# EAGLE design magicmouth-v0.1 (EAGLE 6.3)
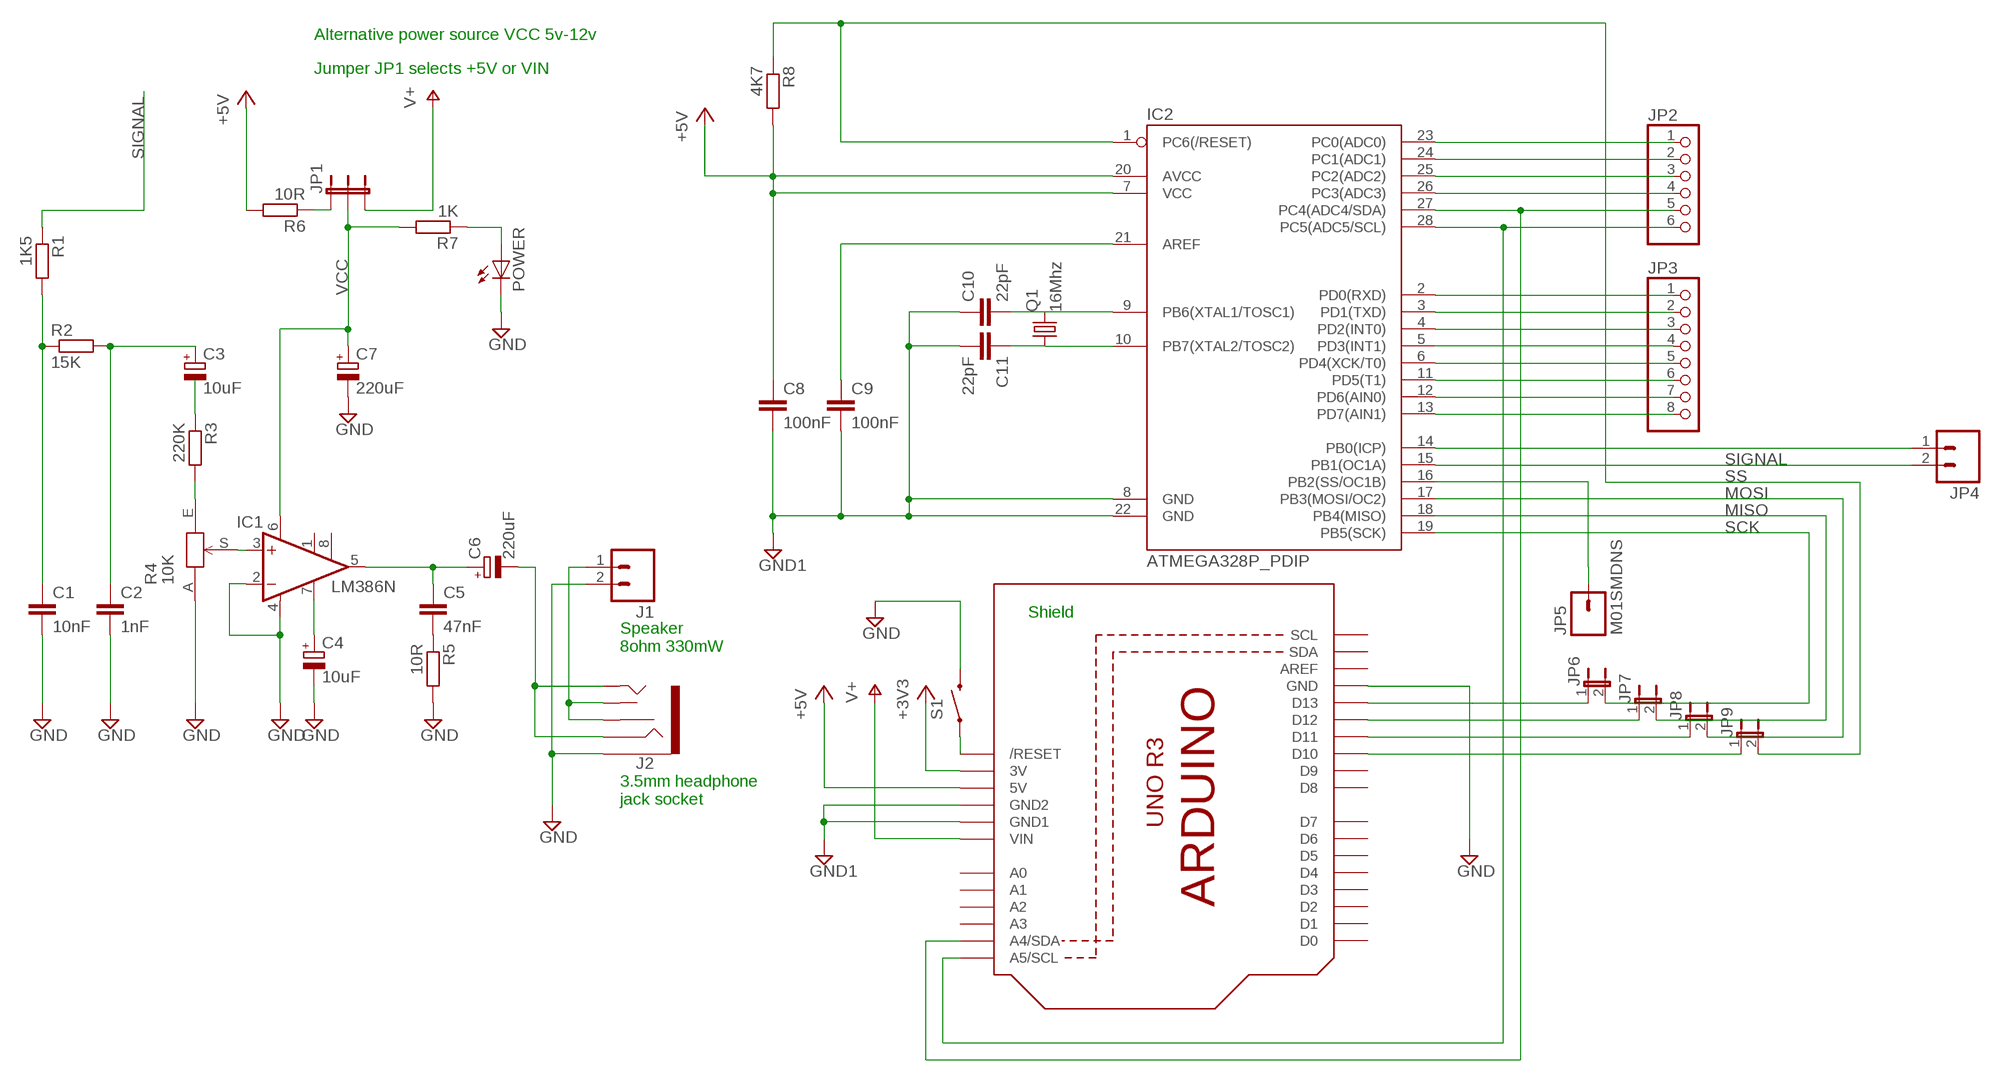
[diagram p0: schematic, sheet 1]

## Parts
C1  10nF  C-EU050-025X075  [C050-025X075]
C2  1nF  C-EU050-025X075  [C050-025X075]
C3  10uF  CPOL-EUE2.5-7  [E2,5-7]
C4  10uF  CPOL-EUE2.5-7  [E2,5-7]
C5  47nF  C-EU050-025X075  [C050-025X075]
C6  220uF  CPOL-EUTT5D7L  [TT5D7L]
C7  220uF  CPOL-EUTT5D7L  [TT5D7L]
C8  100nF  C-EU025-025X050  [C025-025X050]
C9  100nF  C-EU025-025X050  [C025-025X050]
C10  22pF  C-EU025-025X050  [C025-025X050]
C11  22pF  C-EU025-025X050  [C025-025X050]
IC1  LM386N  LM386N-1  [DIL08]
IC2  ATMEGA328P_PDIP  [DIL28-3]
J1  M023.5MM  [SCREWTERMINAL-3.5MM-2]
J2  AUDIO-JACK2PTH  [AUDIO-JACK]
JP1  JUMPER-3PTH  [1X03]
JP2  PINHD-1X6CB  [1X06-CLEANBIG]
JP3  PINHD-1X8CLEANBIG  [1X08-CLEANBIG]
JP4  M021X02_NO_SILK  [1X02_NO_SILK]
JP5  M01SMDNS  [1X01NS]
JP6  JUMPER-2PTH  [1X02]
JP7  JUMPER-2PTH  [1X02]
JP8  JUMPER-2PTH  [1X02]
JP9  JUMPER-2PTH  [1X02]
POWER  LED3MM  [LED3MM]
Q1  16Mhz  CRYSTALHC49S  [HC49/S]
R1  1K5  R-EU_0207/7  [0207/7]
R2  15K  R-EU_0207/7  [0207/7]
R3  220K  R-EU_0207/7  [0207/7]
R4  10K  TPOT3352  [3352T]
R5  10R  R-EU_0207/7  [0207/7]
R6  10R  R-EU_0207/7  [0207/7]
R7  1K  R-EU_0207/7  [0207/7]
R8  4K7  R-EU_0207/7  [0207/7]
S1  SWITCH-MOMENTARY-2PTH  [TACTILE-PTH]
U1  ARDUINOR3-NOIOREF-NOTEXT  [ARDUINOR3-NOTEXT-NOIOREF]

## Nets
+3V3: U1.3V
+5V: C8.1 IC2.7(VCC) IC2.20(AVCC) R6.2 R8.2 U1.5V
GND: C1.2 C2.2 C4.- C7.- IC1.2(-IN) IC1.4(GND) J1.2 J2.SLEEVE POWER.K(C) R4.A R5.2 S1.3 U1.GND
GND1: C8.2 C9.2 C10.1 C11.2 IC2.8(GND) IC2.22(GND) U1.GND1 U1.GND2
MISO: IC2.18(PB4(MISO)) JP7.2
MOSI: IC2.17(PB3(MOSI/OC2)) JP8.2
N$1: C5.1 C6.+ IC1.5(OUT)
N$2: C1.1 R1.2 R2.1
N$3: J1.1 J2.RSH J2.TSH
N$4: C5.2 R5.1
N$5: C3.- R3.1
N$6: C10.2 IC2.9(PB6(XTAL1/TOSC1)) Q1.2
N$7: JP1.1 R6.1
N$8: C6.- J2.RING J2.TIP
N$9: IC1.3(+IN) R4.S
N$10: POWER.A R7.1
N$11: C11.1 IC2.10(PB7(XTAL2/TOSC2)) Q1.1
N$12: IC2.16(PB2(SS/OC1B)) JP5.1
N$13: IC2.23(PC0(ADC0)) JP2.1
N$14: IC2.24(PC1(ADC1)) JP2.2
N$15: IC2.25(PC2(ADC2)) JP2.3
N$16: IC2.2(PD0(RXD)) JP3.1
N$17: IC2.3(PD1(TXD)) JP3.2
N$18: IC2.4(PD2(INT0)) JP3.3
N$19: IC2.5(PD3(INT1)) JP3.4
N$20: IC2.6(PD4(XCK/T0)) JP3.5
N$21: IC2.11(PD5(T1)) JP3.6
N$22: IC2.12(PD6(AIN0)) JP3.7
N$23: IC2.13(PD7(AIN1)) JP3.8
N$24: IC2.14(PB0(ICP)) JP4.1
N$25: JP6.1 U1.D13
N$26: JP7.1 U1.D12
N$27: IC2.26(PC3(ADC3)) JP2.4
N$28: JP8.1 U1.D11
N$29: JP9.1 U1.D10
N$30: IC2.27(PC4(ADC4/SDA)) JP2.5 U1.A4(A4/SDA)
N$31: IC2.28(PC5(ADC5/SCL)) JP2.6 U1.A5(A5/SCL)
N$32: C2.1 C3.+ R2.2
N$33: C4.+ IC1.7(BYPASS)
N$34: C9.1 IC2.21(AREF)
N$35: S1.1 U1.RESET(/RESET)
N$36: R3.2 R4.E
SCK: IC2.19(PB5(SCK)) JP6.2
SIGNAL: IC2.15(PB1(OC1A)) JP4.2 R1.1
SS: IC2.1(PC6(/RESET)) JP9.2 R8.1
VCC: C7.+ IC1.6(VS) JP1.2 R7.2
VIN: JP1.3 U1.VIN ; supply symbol labelled V+
Unconnected: IC1.1(GAIN) IC1.8(GAIN) U1.A0 U1.A1 U1.A2 U1.A3 U1.AREF U1.D0 U1.D1 U1.D2 U1.D3 U1.D4 U1.D5 U1.D6 U1.D7 U1.D8 U1.D9 U1.SCL U1.SDA

## Notes on the sheet
- Alternative power source VCC 5v-12v
- Jumper JP1 selects +5V or VIN
- Shield
- Speaker
  8ohm 330mW
- 3.5mm headphone
  jack socket

## Library data of the parts
C1 C2 C5 = resistor:C-EU: CAPACITOR, European symbol
C3 C4 C6 C7 = rcl:CPOL-EU: POLARIZED CAPACITOR, European symbol
C8 = rcl:C-EU: CAPACITOR, European symbol; CAPACITANCE: 10 nF
C9 = rcl:C-EU: CAPACITOR, European symbol; CAPACITANCE: 100 nF
C10 C11 = rcl:C-EU: CAPACITOR, European symbol; CAPACITANCE: 22 pf
IC1 = linear:LM386?-*: Low Voltage Audio Power Amplifier Source: http://cache.national.com/ds/LM/LM386.pdf
IC2 = SparkFun-DigitalIC:ATMEGA328P_PDIP: uC used in the Arduino 32kb flash, 1k EEPROM, 2k SRAM This is the through-hole version of this chip.
J1 JP4 = SparkFun-Connectors:M02: Header 2 Standard 2-pin 0.1" header. Use with straight break away headers (SKU : PRT-00116), right angle break away headers (PRT-00553), swiss pins (PRT-00743), machine pins (PRT-00117), and female headers (PRT-00115). Molex polarized connector foot print use with SKU : PRT-08233 with associated crimp pins and housings.
J2 = SparkFun-Connectors:AUDIO-JACK2: Stereo audio jack with bypass switches.
JP1 = SparkFun-Passives:JUMPER-3
JP2 = adafruit:PINHD-1X6: PIN HEADER
JP3 = adafruit:PINHD-1X8: PIN HEADER
JP5 = SparkFun-Connectors:M01: Header 1 Standard 1-pin 0.1" header. Use with straight break away headers (SKU : PRT-00116), right angle break away headers (PRT-00553), swiss pins (PRT-00743), machine pins (PRT-00117), and female headers (PRT-00115).
JP6-JP9 = SparkFun-Passives:JUMPER-2: Jumper Basic 0.1" spaced jumper. Use with breakaway headers.
POWER = led:LED: LED OSRAM: - CHIPLED LG R971, LG N971, LY N971, LG Q971, LY Q971, LO R971, LY R971 LH N974, LH R974 LS Q976, LO Q976, LY Q976 LO Q996 - Hyper CHIPLED LW Q18S LB Q993, LB Q99A, LB R99A - SideLED LS A670, LO A670, LY A670, LG A670, LP A670 LB A673, LV A673, LT A673, LW A673 LH A674 LY A675 LS A676, LA A676, LO A676, LY A676, LW A676 LS A679, LY A679, LG A679 - Hyper Micro SIDELED® LS Y876, LA Y876, LO Y876, LY Y876 LT Y87S - SmartLED LW L88C, LW L88S LB L89C, LB L89S, LG L890 LS L89K, LO L89K, LY L89K LS L896, LA L896, LO L896, LY L896 - TOPLED LS T670, LO T670, LY T670, LG T670, LP T670 LSG T670, LSP T670, LSY T670, LOP T670, LYG T670 LG T671, LOG T671, LSG T671 LB T673, LV T673, LT T673, LW T673 LH T674 LS T676, LA T676, LO T676, LY T676, LB T676, LH T676, LSB T676, LW T676 LB T67C, LV T67C, LT T67C, LS T67K, LO T67K, LY T67K, LW E67C LS E67B, LA E67B, LO E67B, LY E67B, LB E67C, LV E67C, LT E67C LW T67C LS T679, LY T679, LG T679 LS T770, LO T770, LY T770, LG T770, LP T770 LB T773, LV T773, LT T773, LW T773 LH T774 LS E675, LA E675, LY E675, LS T675 LS T776, LA T776, LO T776, LY T776, LB T776 LHGB T686 LT T68C, LB T68C - Hyper Mini TOPLED® LB M676 - Mini TOPLED Santana® LG M470 LS M47K, LO M47K, LY M47K Source: http://www.osram.convergy.de - LUMILED® LXK2-PW12-R00, LXK2-PW12-S00, LXK2-PW14-U00, LXK2-PW14-V00 LXK2-PM12-R00, LXK2-PM12-S00, LXK2-PM14-U00 LXK2-PE12-Q00, LXK2-PE12-R00, LXK2-PE12-S00, LXK2-PE14-T00, LXK2-PE14-U00 LXK2-PB12-K00, LXK2-PB12-L00, LXK2-PB12-M00, LXK2-PB14-N00, LXK2-PB14-P00, LXK2-PB14-Q00 LXK2-PR12-L00, LXK2-PR12-M00, LXK2-PR14-Q00, LXK2-PR14-R00 LXK2-PD12-Q00, LXK2-PD12-R00, LXK2-PD12-S00 LXK2-PH12-R00, LXK2-PH12-S00 LXK2-PL12-P00, LXK2-PL12-Q00, LXK2-PL12-R00 Source: www.luxeon.com
Q1 = crystal:CRYSTAL: CRYSTAL; OC_FARNELL: 1667008; OC_NEWARK: unknown
R1-R3 R6 R7 = rcl:R-EU_: RESISTOR, European symbol
R4 = t0mpr1c3:TPOT: Bourns thumbwheel trimmer resistor
R5 = resistor:R-EU_: RESISTOR, European symbol
R8 = rcl:R-EU_: RESISTOR, European symbol; RESISTANCE: 4K7
S1 = SparkFun-Electromechanical:SWITCH-MOMENTARY-2: Various NO switches- pushbuttons, reed, etc
U1 = adafruit:ARDUINOR3-NOIOREF

## Board
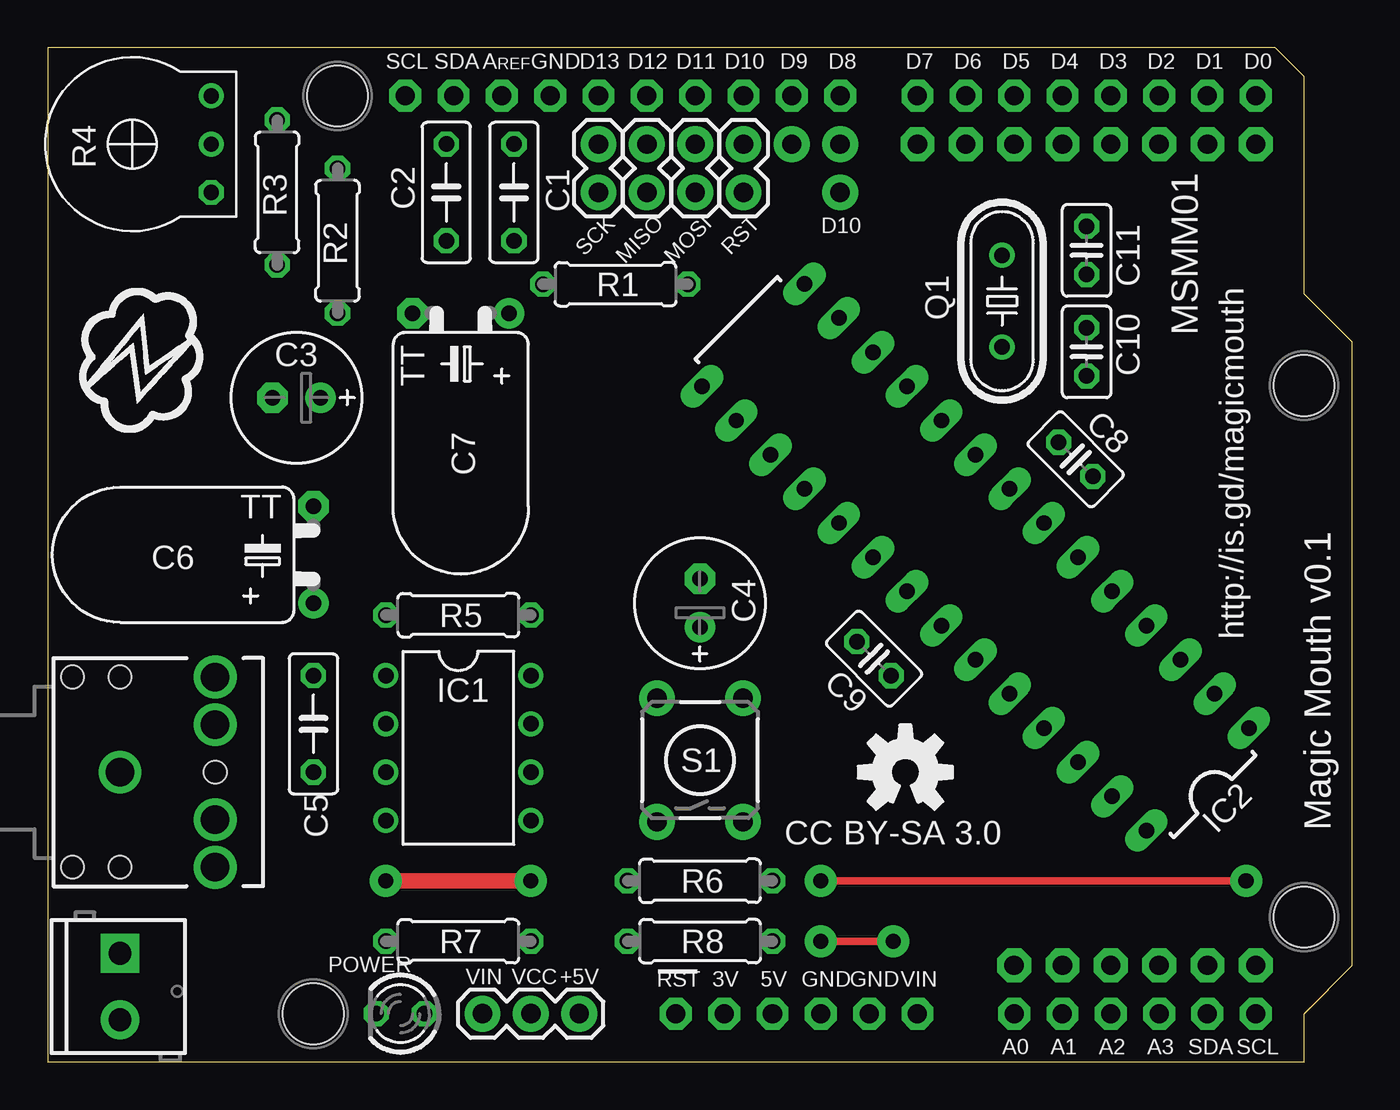
[diagram p1: board, top side]
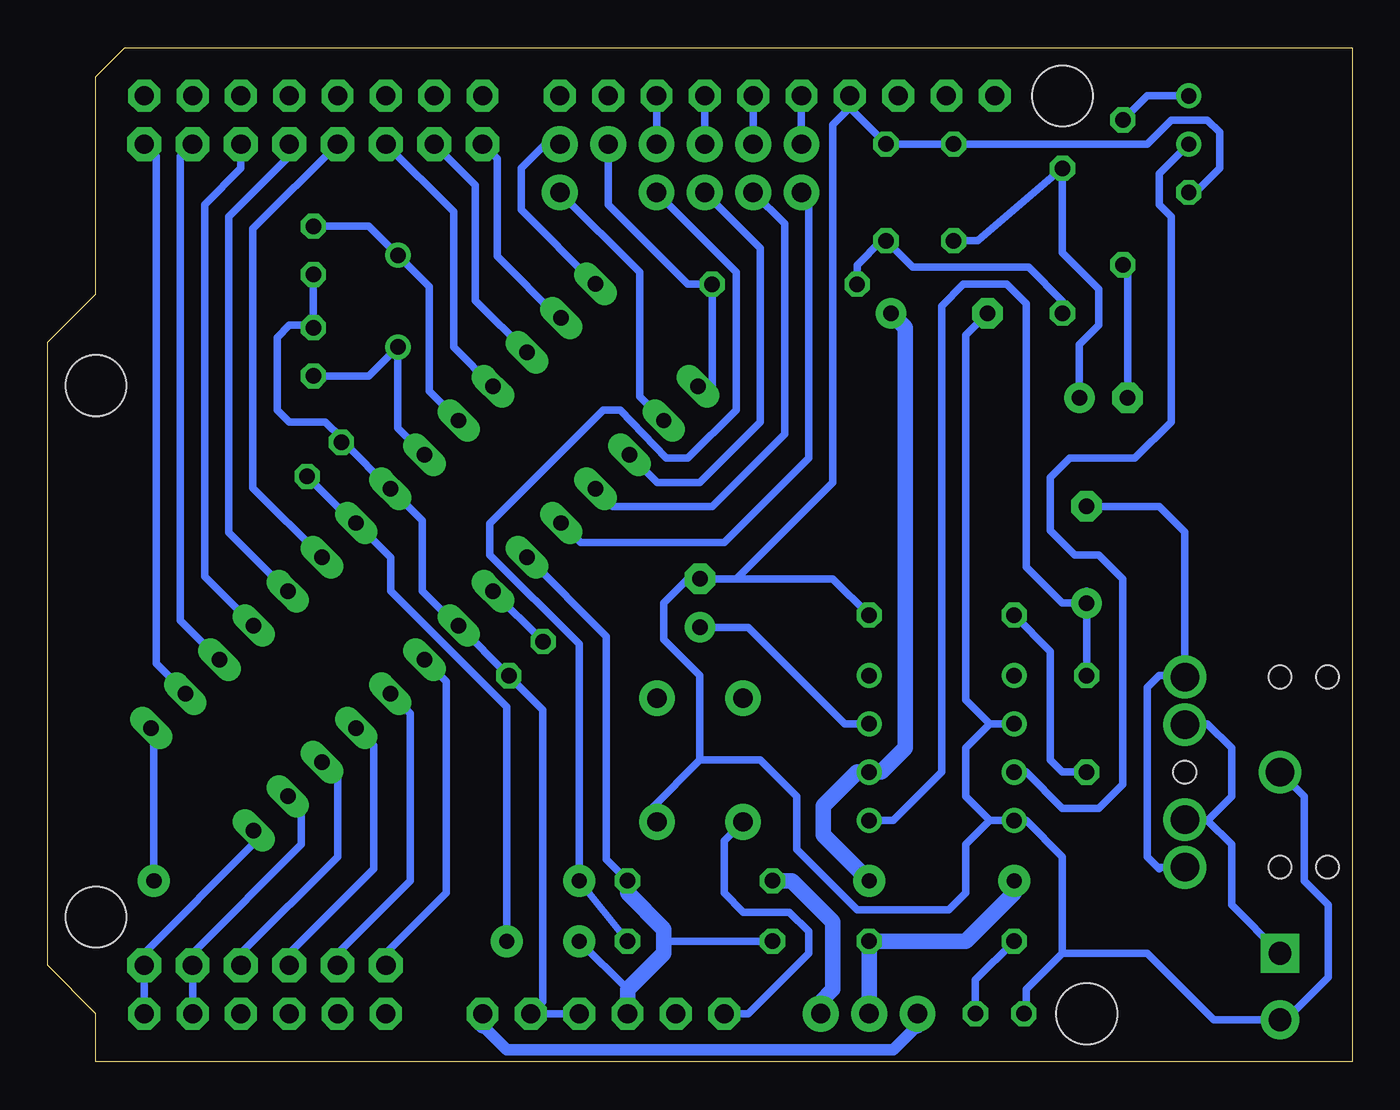
[diagram p2: board, bottom side, seen from below]

Size 68.58 x 53.34 mm. Coordinates in mm from the lower left corner, seen from the top.
Outline: 0,0 66.04,0 66.04,2.54 68.58,5.08 68.58,37.85 66.04,40.39 66.04,41.34 66.04,51.82 64.52,53.34 0,53.33 0,0
Copper layers (1*16): Top 0.035mm / dielectric 1.5mm / Bottom 0.035mm
Design rules "Fusion_eagle_rule_v1.1": minimum track width 6mil, minimum drill 12mil, track to track 6mil, track to pad 6mil, pad to pad 6mil, via to via 6mil, smd to smd 0mil, copper to edge 10mil, drill to drill 10mil, minimum pad ring 10mil, minimum via ring 6mil, stop-mask expansion 2mil, vias tented up to drill 100mil, thermal gap 10mil
Holes 3.2 mm at 13.97,2.54 15.24,50.8 66.04,35.56 66.04,7.62

### Footprints (pad centres in the part's own frame; a part is rotated, then mirrored left to right if it is on the bottom)
C050-025X075 = drill 0.813 octagon: 1 -2.54,0; 2 2.54,0
E2,5-7 = drill 0.813 pad 1.6: + -1.27,0 | drill 0.813 pad 1.6 octagon: - 1.27,0
TT5D7L = drill 0.813 pad 1.6: + -2.54,0 | drill 0.813 pad 1.6 octagon: - 2.54,0
C025-025X050 = drill 0.813 octagon: 1 -1.27,0; 2 1.27,0
DIL08 = drill 0.813 pad 1.27: 1 -3.81,-3.81; 2 -1.27,-3.81; 3 1.27,-3.81; 4 3.81,-3.81; 5 3.81,3.81; 6 1.27,3.81; 7 -1.27,3.81; 8 -3.81,3.81
DIL28-3 = drill 0.813 long: 1 -16.51,-3.81; 2 -13.97,-3.81; 3 -11.43,-3.81; 4 -8.89,-3.81; 5 -6.35,-3.81; 6 -3.81,-3.81; 7 -1.27,-3.81; 8 1.27,-3.81; 9 3.81,-3.81; 10 6.35,-3.81; 11 8.89,-3.81; 12 11.43,-3.81; 13 13.97,-3.81; 14 16.51,-3.81; 15 16.51,3.81; 16 13.97,3.81; 17 11.43,3.81; 18 8.89,3.81; 19 6.35,3.81; 20 3.81,3.81; 21 1.27,3.81; 22 -1.27,3.81; 23 -3.81,3.81; 24 -6.35,3.81; 25 -8.89,3.81; 26 -11.43,3.81; 27 -13.97,3.81; 28 -16.51,3.81
SCREWTERMINAL-3.5MM-2 = drill 1.2 pad 2.032 square: 1 0,0 | drill 1.2 pad 2.032: 2 3.5,0
AUDIO-JACK = drill 1.5 pad 2.184: RING 5,5; RSH 5,2.5; SLEEVE 0,0; TIP 5,-5; TSH 5,-2.5 | hole 1.2: 0,5; -2.5,5; -2.5,-5; 0,-5; 5,0
1X03 = drill 1.016 pad 1.88: 1 0,0; 2 2.54,0; 3 5.08,0
1X06-CLEANBIG = drill 1.016 pad 1.778 octagon: 1 -6.35,0; 2 -3.81,0; 3 -1.27,0; 4 1.27,0; 5 3.81,0; 6 6.35,0
1X08-CLEANBIG = drill 1.016 pad 1.778 octagon: 1 -8.89,0; 2 -6.35,0; 3 -3.81,0; 4 -1.27,0; 5 1.27,0; 6 3.81,0; 7 6.35,0; 8 8.89,0
1X02_NO_SILK = drill 1.016 pad 1.88: 1 0,0; 2 2.54,0
1X01NS = drill 1.016 pad 1.88: 1 0,0
1X02 = drill 1.016 pad 1.88: 1 0,0; 2 2.54,0
LED3MM = drill 0.813 octagon: A -1.27,0; K 1.27,0
HC49/S = drill 0.813: 1 -2.413,0; 2 2.413,0
0207/7 = drill 0.813 octagon: 1 -3.81,0; 2 3.81,0
3352T = drill 0.8 pad 1.27 octagon: A -2.54,-4.16 | drill 0.8 pad 1.27: E 2.54,-4.16; S 0,-4.16
TACTILE-PTH = drill 1.016 pad 1.88: 1 -3.251,2.261; 2 3.251,2.261; 3 -3.251,-2.261; 4 3.251,-2.261
ARDUINOR3-NOTEXT-NOIOREF = drill 1 pad 1.676 octagon: 3V 35.56,2.54; 5V 38.1,2.54; A0 50.8,2.54; A1 53.34,2.54; A2 55.88,2.54; A3 58.42,2.54; A4 60.96,2.54; A5 63.5,2.54; AREF 23.876,50.8; D0 63.5,50.8; D1 60.96,50.8; D2 58.42,50.8; D3 55.88,50.8; D4 53.34,50.8; D5 50.8,50.8; D6 48.26,50.8; D7 45.72,50.8; D8 41.656,50.8; D9 39.116,50.8; D10 36.576,50.8; D11 34.036,50.8; D12 31.496,50.8; D13 28.956,50.8; GND 26.416,50.8; GND1 43.18,2.54; GND2 40.64,2.54; RESET 33.02,2.54; SCL 18.796,50.8; SDA 21.336,50.8; VIN 45.72,2.54

### Placement (x,y rotation side)
C1  24.51,45.72 90 top
C2  20.95,45.72 90 top
C3  13.08,34.92 180 top
C4  34.29,24.13 90 top
C5  13.97,17.78 270 top
C6  13.97,26.67 90 top
C7  21.72,39.37 180 top
C8  54.04,31.69 135 top
C9  43.43,21.21 315 top
C10  54.61,37.34 270 top
C11  54.61,42.67 270 top
IC1  21.59,16.51 270 top
IC2  48.77,26.54 135 top
J1  3.81,5.71 270 top
J2  3.81,15.24 0 top
JP1  27.94,2.54 180 top
JP2  57.15,5.08 0 top
JP3  54.61,48.26 180 top
JP4  41.66,48.26 180 top
JP5  41.66,45.72 0 top
JP6  28.96,48.26 270 top
JP7  31.5,48.26 270 top
JP8  34.04,48.26 270 top
JP9  36.58,48.26 270 top
POWER  18.54,2.54 180 top
Q1  50.16,40.01 270 top
R1  29.84,40.89 180 top
R2  15.24,43.18 90 top
R3  12.06,45.72 90 top
R4  4.45,48.26 90 top
R5  21.59,23.5 0 top
R6  34.29,9.53 0 top
R7  21.59,6.35 0 top
R8  34.29,6.35 180 top
S1  34.29,15.88 90 top
U1  0,0 0 top
U$1  [OSHW-LOGO-M]  45.09,15.24 0 top

### Tracks (layer width: path | path; a pad name or v marks a point on that pad's centre or on a via)
+5V  (via drill 0.8 pad 1.68)
  Top 0.406: v40.64,6.35 v44.45,6.35
  Bottom 0.406: 38.1,3.81 v40.64,6.35 | v44.45,6.35 44.45,18.67 50.55,24.77 50.55,26.52 IC2.7 52.49,28.34 C8.1 | R6.2 39.22,10.64 39.22,22.38 IC2.20 | R8.2 36.2,6.35
  Bottom 0.813: U1.5V 38.1,3.81 36.2,5.71 36.2,6.35 36.2,6.99 38.1,8.89 R6.2
GND
  Bottom 0.406: IC1.2 19.05,17.78 | 19.05,17.78 20.32,16.51 20.32,13.97 19.05,12.7 | 19.05,12.7 IC1.4 17.14,12.7 15.24,10.79 15.24,5.71 | 19.05,17.78 20.32,19.05 20.32,38.23 C7.- | 15.24,5.71 17.14,3.81 17.14,2.67 POWER.K | 15.24,5.71 10.79,5.71 7.29,2.21 J1.2 3.5,2.21 1.27,4.45 1.27,8.26 2.54,9.53 2.54,13.97 J2.SLEEVE | 19.05,12.7 20.32,11.43 20.32,8.89 21.21,8 26.04,8 29.21,11.18 29.21,13.97 31.11,15.88 34.29,15.88 | 25.15,23.62 25.27,23.5 R5.2 27.3,25.4 32.38,25.4 | U1.GND 26.42,50.16 | 26.42,50.16 C1.2 C2.2 10.79,48.26 9.53,49.53 7.62,49.53 6.99,48.9 6.99,46.99 8.26,45.72 R4.A | 26.42,50.16 27.3,49.28 27.3,30.48 32.38,25.4 | 32.38,25.4 C4.- 34.92,25.4 36.2,24.13 36.2,22.23 34.29,20.32 34.29,15.88 | S1.3 36.55,13.06 36.83,13.34 34.29,15.88
GND1
  Bottom 0.406: U1.GND2 U1.GND1 42.55,3.17 42.55,18.52 C9.2 IC2.22 47.08,22.95 48.9,24.77 48.9,28.47 IC2.8 53.01,32.59 C8.2 53.14,32.82 53.98,33.66 55.88,33.66 56.52,34.29 56.52,38.1 55.88,38.73 54.74,38.73 C10.1 C11.2
MISO
  Bottom 0.406: JP7.2 29.84,44.07 29.84,33.02 33.66,29.21 38.86,29.21 IC2.18
MOSI
  Bottom 0.406: JP8.2 31.11,42.8 31.11,33.66 34.29,30.48 36.54,30.48 IC2.17
N$1
  Bottom 0.406: IC1.5 24.13,12.7 21.59,15.24 21.59,39.75 20.45,40.89 18.16,40.89 17.14,39.88 17.14,26.04 15.24,24.13 C6.+ | C6.+ C5.1 | 13.97,24.77 C6.+
N$2
  Bottom 0.406: R1.2 26.04,41.91 24.77,43.18 C1.1 23.11,41.78 17.02,41.78 15.24,40.01 R2.1
N$3
  Bottom 0.406: J1.1 6.35,8.26 6.35,11.43 7.62,12.7 8.77,12.7 J2.TSH 7.58,12.74 6.35,13.97 6.35,16.51 7.62,17.78 8.77,17.78 J2.RSH
N$4
  Bottom 0.406: C5.2 15.24,15.24 15.88,15.88 15.88,21.59 R5.1
N$5
  Bottom 0.406: C3.- 11.81,41.66 R3.1
N$6
  Bottom 0.406: C10.2 51.69,36.07 Q1.2 50.16,33.33 IC2.9
N$7
  Bottom 0.813: JP1.1 27.94,3.17 27.3,3.81 27.3,7.37 29.46,9.53 R6.1
N$8
  Bottom 0.406: C6.- 10.16,29.21 8.81,27.86 J2.RING 8.89,20.32 10.16,20.32 10.79,19.68 10.79,10.79 10.16,10.16 10.08,10.24 J2.TIP
N$9
  Bottom 0.406: IC1.3 17.14,15.24 15.24,13.34 13.34,13.34 12.06,14.61 12.06,25.4 13.34,26.67 14.61,26.67 15.88,27.94 15.88,30.73 14.86,31.75 11.43,31.75 9.53,33.66 9.53,44.45 10.16,45.09 10.16,46.7 R4.S
N$10
  Bottom 0.406: POWER.A 19.81,4.32 R7.1
N$11
  Bottom 0.406: C11.1 51.69,43.94 Q1.1 48.51,40.77 48.51,35.27 IC2.10
N$12
  Bottom 0.406: JP5.1 37.47,41.53 37.47,35 IC2.16
N$13
  Bottom 0.406: JP2.1 50.8,5.71 47.62,8.89 47.62,20.01 IC2.23
N$14
  Bottom 0.406: JP2.2 53.34,5.71 49.53,9.53 49.53,18.32 IC2.24
N$15
  Bottom 0.406: JP2.3 55.88,5.71 51.44,10.16 51.44,16.64 IC2.25
N$16
  Bottom 0.406: IC2.2 61.34,19.43 62.87,20.95 62.87,47.62 JP3.1
N$17
  Bottom 0.406: IC2.3 61.59,23.21 61.59,47.62 JP3.2
N$18
  Bottom 0.406: JP3.3 58.42,46.99 60.33,45.09 60.33,25.53 IC2.4
N$19
  Bottom 0.406: JP3.4 55.88,47.62 59.05,44.45 59.05,27.85 IC2.5
N$20
  Bottom 0.406: JP3.5 57.78,43.81 57.78,30.17 IC2.6
N$21
  Bottom 0.406: JP3.6 47.24,44.7 47.24,37.59 IC2.11
N$22
  Bottom 0.406: JP3.7 46.1,46.1 46.1,40.04 IC2.12
N$23
  Bottom 0.406: JP3.8 44.96,47.5 44.96,42.36 41.71,39.12 IC2.13
N$24
  Bottom 0.406: JP4.1 42.42,48.26 43.69,46.99 43.69,44.81 IC2.14
N$25
  Bottom 0.406: JP6.1 U1.D13
N$26
  Bottom 0.406: JP7.1 U1.D12
N$27
  Bottom 0.406: JP2.4 58.42,5.71 53.34,10.79 53.34,14.95 IC2.26
N$28
  Bottom 0.406: JP8.1 U1.D11
N$29
  Bottom 0.406: JP9.1 U1.D10
N$30
  Bottom 0.406: U1.A4 JP2.5 60.96,5.71 55.24,11.43 55.24,13.26 IC2.27
N$31
  Bottom 0.406: IC2.28 57.78,12.14 57.78,11.43 63.5,5.71 JP2.6 U1.A5
N$32
  Bottom 0.406: C3.+ 14.35,37.72 13.34,38.73 13.34,40.64 15.24,42.55 R2.2 19.68,43.18 C2.1
N$33
  Bottom 0.406: IC1.7 26.67,17.78 31.75,22.86 C4.+
N$34
  Bottom 0.406: C9.1 IC2.21
N$35
  Bottom 0.406: U1.RESET 31.75,2.54 28.57,5.71 28.57,6.86 29.59,7.87 32,7.87 33.02,8.89 33.02,11.63 S1.1
N$36
  Bottom 0.406: R4.E 10.79,50.8 R3.2
SCK
  Bottom 0.406: JP6.2 28.57,45.34 28.57,31.75 33.02,27.3 40.55,27.3 IC2.19
SIGNAL
  Bottom 0.406: JP4.2 39.12,45.09 34.92,40.89 R1.1 33.66,35.25 IC2.15
SS  (via drill 0.8 pad 1.68)
  Top 0.406: v40.64,9.53 v62.99,9.53
  Bottom 0.406: JP9.2 32.38,41.53 32.38,34.29 34.92,31.75 36.07,31.75 38.48,34.29 39.37,34.29 45.34,28.32 45.34,26.67 40.64,21.97 v40.64,9.53 R8.1 | v62.99,9.53 62.99,16.69 IC2.1
VCC  (via drill 0.8 pad 1.68)
  Top 0.813: v17.78,9.53 v25.4,9.53
  Bottom 0.813: v25.4,9.53 27.81,11.94 27.81,13.46 26.04,15.24 IC1.6 24.77,15.24 23.5,16.51 23.5,38.61 C7.+ | JP1.2 R7.2 20.32,6.35 17.78,8.89 v17.78,9.53
VIN
  Bottom 0.61: 22.86,1.91 24.13,0.64 44.45,0.64 45.72,1.91
  Bottom 0.813: JP1.3 22.86,1.91 | 45.72,1.91 U1.VIN

### Text on the board
tPlace: SCL | SDA | A | REF | GND | D13 | D12 | D11 | D10 | D9 | D8 | D7 | D6 | D5 | D4 | D3 | D2 | D1 | D0 | SCK | MISO | MOSI | RST | D10 | MSMM01 | http://is.gd/magicmouth | Magic Mouth v0.1 | CC BY-SA 3.0 | _ | VIN | VCC | +5V | RST | 3V | 5V | GND | GND | VIN | A0 | A1 | A2 | A3 | SDA | SCL